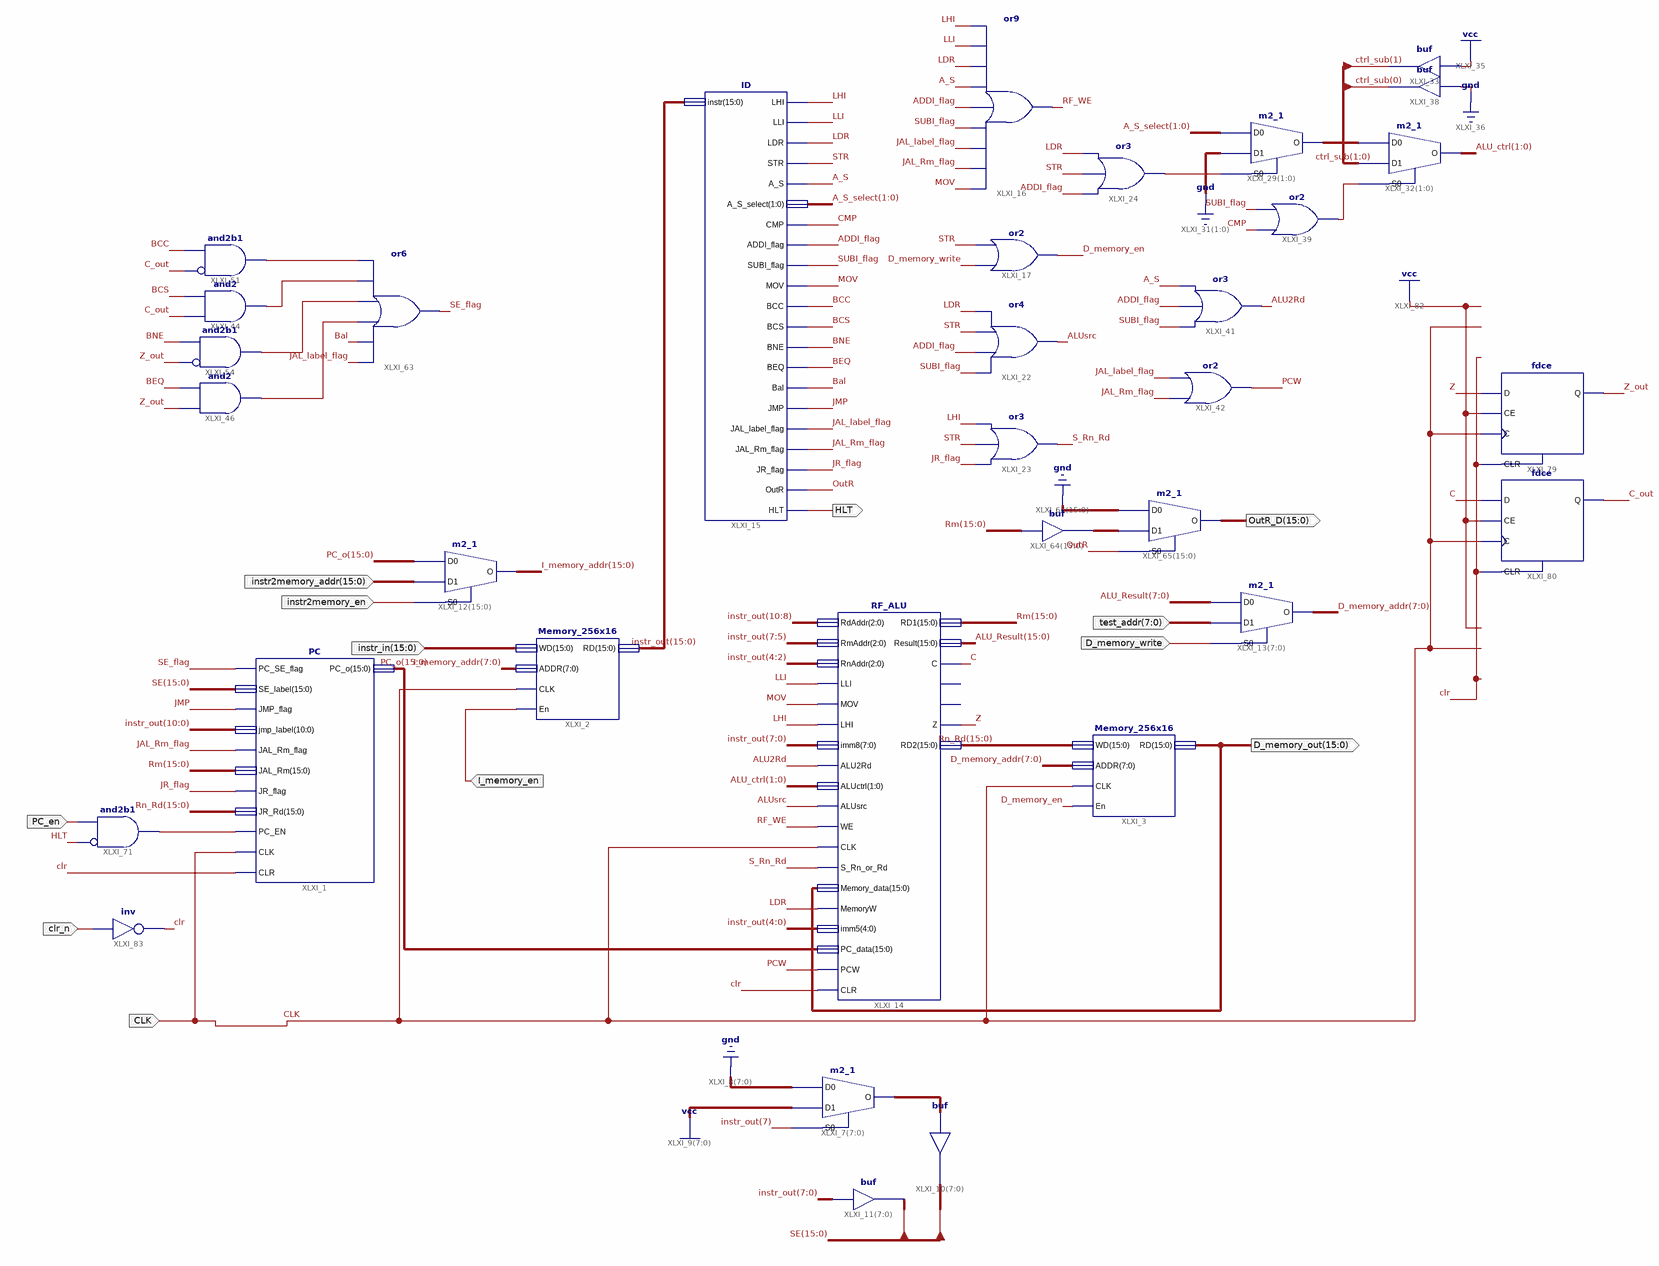
[diagram p0: schematic sheet 1]
// Xilinx ISE schematic RISC_CPU_16.sch (artix7) as structural Verilog: 33 symbols, 12 ports
module RISC_CPU_16 (
  input  CLK,
  input  I_memory_en,
  input  [15:0] instr_in,
  input  instr2memory_en,
  input  [15:0] instr2memory_addr,
  input  D_memory_write,
  input  [7:0] test_addr,
  input  PC_en,
  input  clr_n,
  output [15:0] D_memory_out,
  output HLT,
  output [15:0] OutR_D
);

  wire A_S, ADDI_flag, ALU2Rd, ALUsrc, Bal, BCC, BCS, BEQ, BNE, C, C_out, clr, CMP, D_memory_en,
       JAL_label_flag, JAL_Rm_flag, JMP, JR_flag, LDR, LHI, LLI, MOV, OutR, PCW, RF_WE, S_Rn_Rd, SE_flag,
       STR, SUBI_flag, XLXN_174, XLXN_187, XLXN_233, XLXN_234, XLXN_235, XLXN_236, XLXN_250, Z, Z_out;
  wire [1:0] A_S_select, ALU_ctrl, ctrl_sub, XLXN_177;
  wire [7:0] D_memory_addr, XLXN_37;
  wire [15:0] ALU_Result, I_memory_addr, instr_out, PC_o, Rm, Rn_Rd, SE, XLXN_241;

  Memory_256x16 XLXI_3 (.ADDR(D_memory_addr), .CLK(CLK), .En(D_memory_en), .RD(D_memory_out), .WD(Rn_Rd));
  PC XLXI_1 (
    .CLK(CLK), .CLR(clr), .JAL_Rm(Rm), .JAL_Rm_flag(JAL_Rm_flag), .JMP_flag(JMP),
    .jmp_label(instr_out[10:0]), .JR_flag(JR_flag), .JR_Rd(Rn_Rd), .PC_EN(XLXN_250), .PC_o(PC_o),
    .PC_SE_flag(SE_flag), .SE_label(SE));
  Memory_256x16 XLXI_2 (.ADDR(I_memory_addr[7:0]), .CLK(CLK), .En(I_memory_en), .RD(instr_out), .WD(instr_in));
  m2_1 XLXI_7[7:0] (.D0({8{1'b0}}), .D1({8{1'b1}}), .S0(instr_out[7]), .O(XLXN_37));
  assign SE[15:8] = XLXN_37;  // buf XLXI_10[7..0], 8 bits wide
  assign SE[7:0] = instr_out[7:0];  // buf XLXI_11[7..0], 8 bits wide
  m2_1 XLXI_12[15:0] (.D0(PC_o), .D1(instr2memory_addr), .S0(instr2memory_en), .O(I_memory_addr));
  m2_1 XLXI_13[7:0] (.D0(ALU_Result[7:0]), .D1(test_addr), .S0(D_memory_write), .O(D_memory_addr));
  RF_ALU XLXI_14 (
    .ALU2Rd(ALU2Rd), .ALUctrl(ALU_ctrl), .ALUsrc(ALUsrc), .C(C), .CLK(CLK), .CLR(clr), .imm5(instr_out[4:0]),
    .imm8(instr_out[7:0]), .LHI(LHI), .LLI(LLI), .MemoryW(LDR), .Memory_data(D_memory_out), .MOV(MOV),
    .PCW(PCW), .PC_data(PC_o), .RD1(Rm), .RD2(Rn_Rd), .RdAddr(instr_out[10:8]), .Result(ALU_Result),
    .RmAddr(instr_out[7:5]), .RnAddr(instr_out[4:2]), .S_Rn_or_Rd(S_Rn_Rd), .WE(RF_WE), .Z(Z));  // open: N, V
  ID XLXI_15 (
    .ADDI_flag(ADDI_flag), .A_S(A_S), .A_S_select(A_S_select), .Bal(Bal), .BCC(BCC), .BCS(BCS), .BEQ(BEQ),
    .BNE(BNE), .CMP(CMP), .HLT(HLT), .instr(instr_out), .JAL_label_flag(JAL_label_flag),
    .JAL_Rm_flag(JAL_Rm_flag), .JMP(JMP), .JR_flag(JR_flag), .LDR(LDR), .LHI(LHI), .LLI(LLI), .MOV(MOV),
    .OutR(OutR), .STR(STR), .SUBI_flag(SUBI_flag));
  or XLXI_17 (D_memory_en, D_memory_write, STR);
  or XLXI_22 (ALUsrc, SUBI_flag, ADDI_flag, STR, LDR);
  or XLXI_23 (S_Rn_Rd, JR_flag, STR, LHI);
  or XLXI_16 (RF_WE, MOV, JAL_Rm_flag, JAL_label_flag, SUBI_flag, ADDI_flag, A_S, LDR, LLI, LHI);
  m2_1 XLXI_29[1:0] (.D0(A_S_select), .D1(2'b00), .S0(XLXN_174), .O(XLXN_177));
  m2_1 XLXI_32[1:0] (.D0(XLXN_177), .D1(ctrl_sub), .S0(XLXN_187), .O(ALU_ctrl));
  buf XLXI_33 (ctrl_sub[1], 1'b1);
  buf XLXI_38 (ctrl_sub[0], 1'b0);
  or XLXI_39 (XLXN_187, CMP, SUBI_flag);
  or XLXI_41 (ALU2Rd, SUBI_flag, ADDI_flag, A_S);
  or XLXI_42 (PCW, JAL_Rm_flag, JAL_label_flag);
  assign XLXN_241 = Rm;  // buf XLXI_64[15..0], 16 bits wide
  m2_1 XLXI_65[15:0] (.D0({16{1'b0}}), .D1(XLXN_241), .S0(OutR), .O(OutR_D));
  and XLXI_71 (XLXN_250, ~HLT, PC_en);  // and2b1
  or XLXI_24 (XLXN_174, ADDI_flag, STR, LDR);
  and XLXI_51 (XLXN_233, ~C_out, BCC);  // and2b1
  and XLXI_44 (XLXN_234, C_out, BCS);
  and XLXI_54 (XLXN_235, ~Z_out, BNE);  // and2b1
  and XLXI_46 (XLXN_236, Z_out, BEQ);
  or XLXI_63 (SE_flag, JAL_label_flag, Bal, XLXN_236, XLXN_235, XLXN_234, XLXN_233);
  fdce XLXI_79 (.C(CLK), .CE(1'b1), .CLR(clr), .D(Z), .Q(Z_out));
  fdce XLXI_80 (.C(CLK), .CE(1'b1), .CLR(clr), .D(C), .Q(C_out));
  not XLXI_83 (clr, clr_n);
endmodule
